# EAGLE board ASIC_card (EAGLE 6.3), part 1 of 2
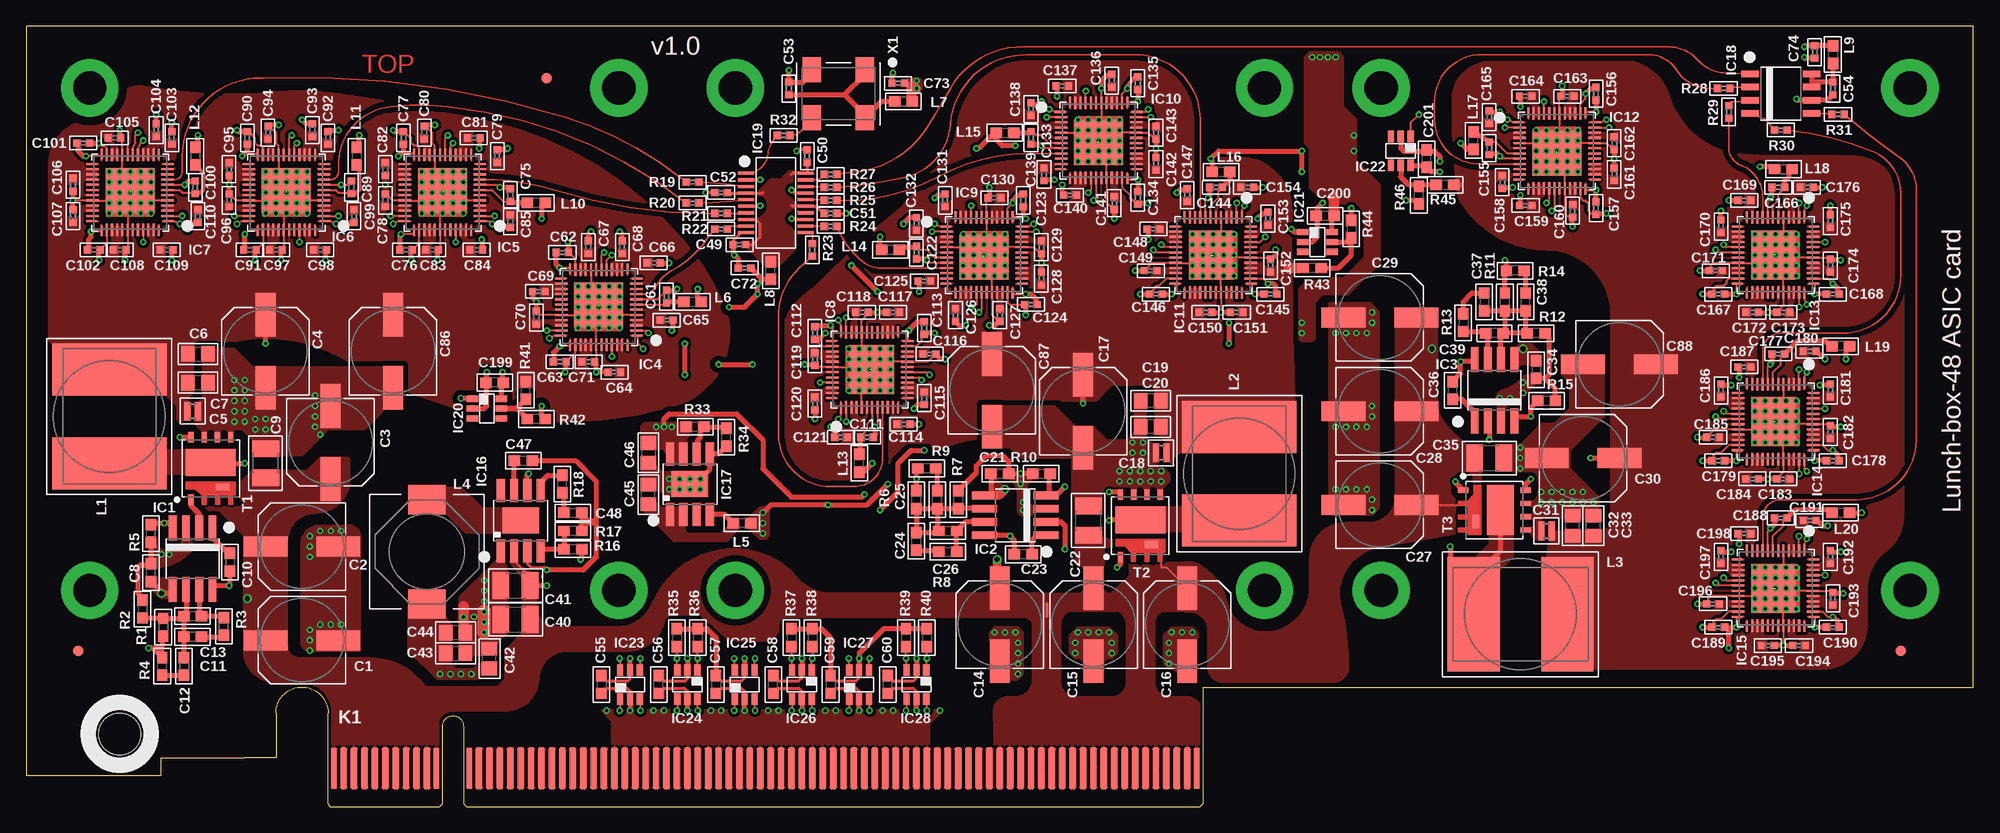
[diagram p4: board, top side]
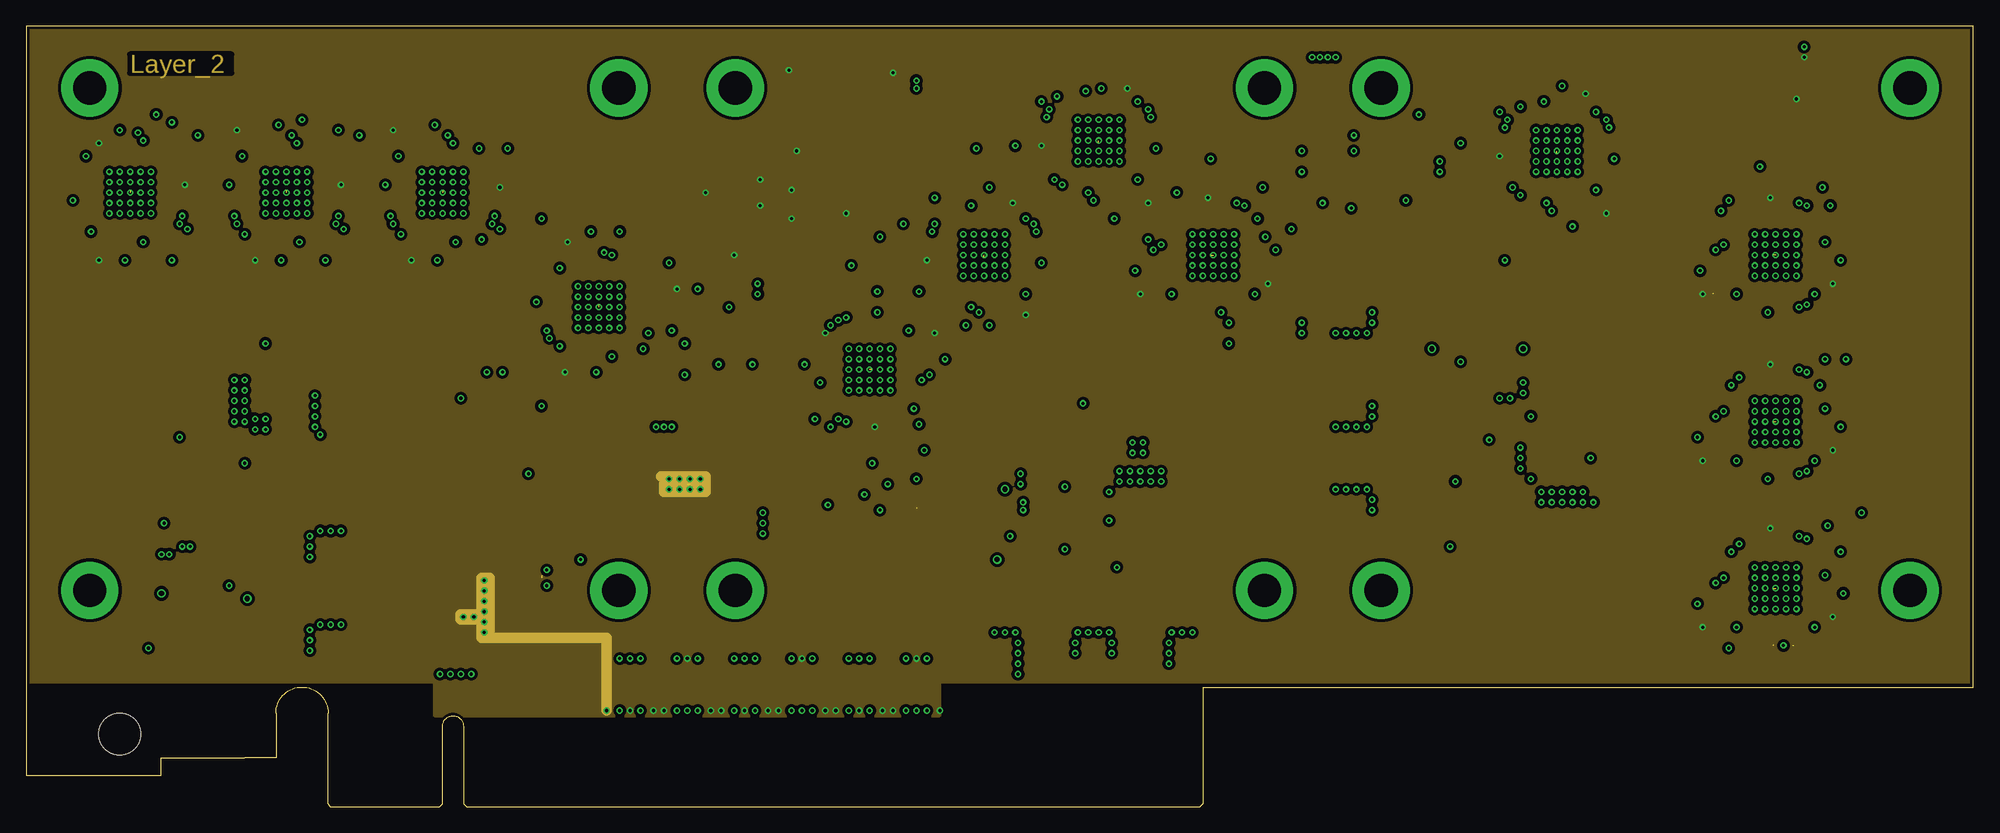
[diagram p5: board, inner layer Route2]
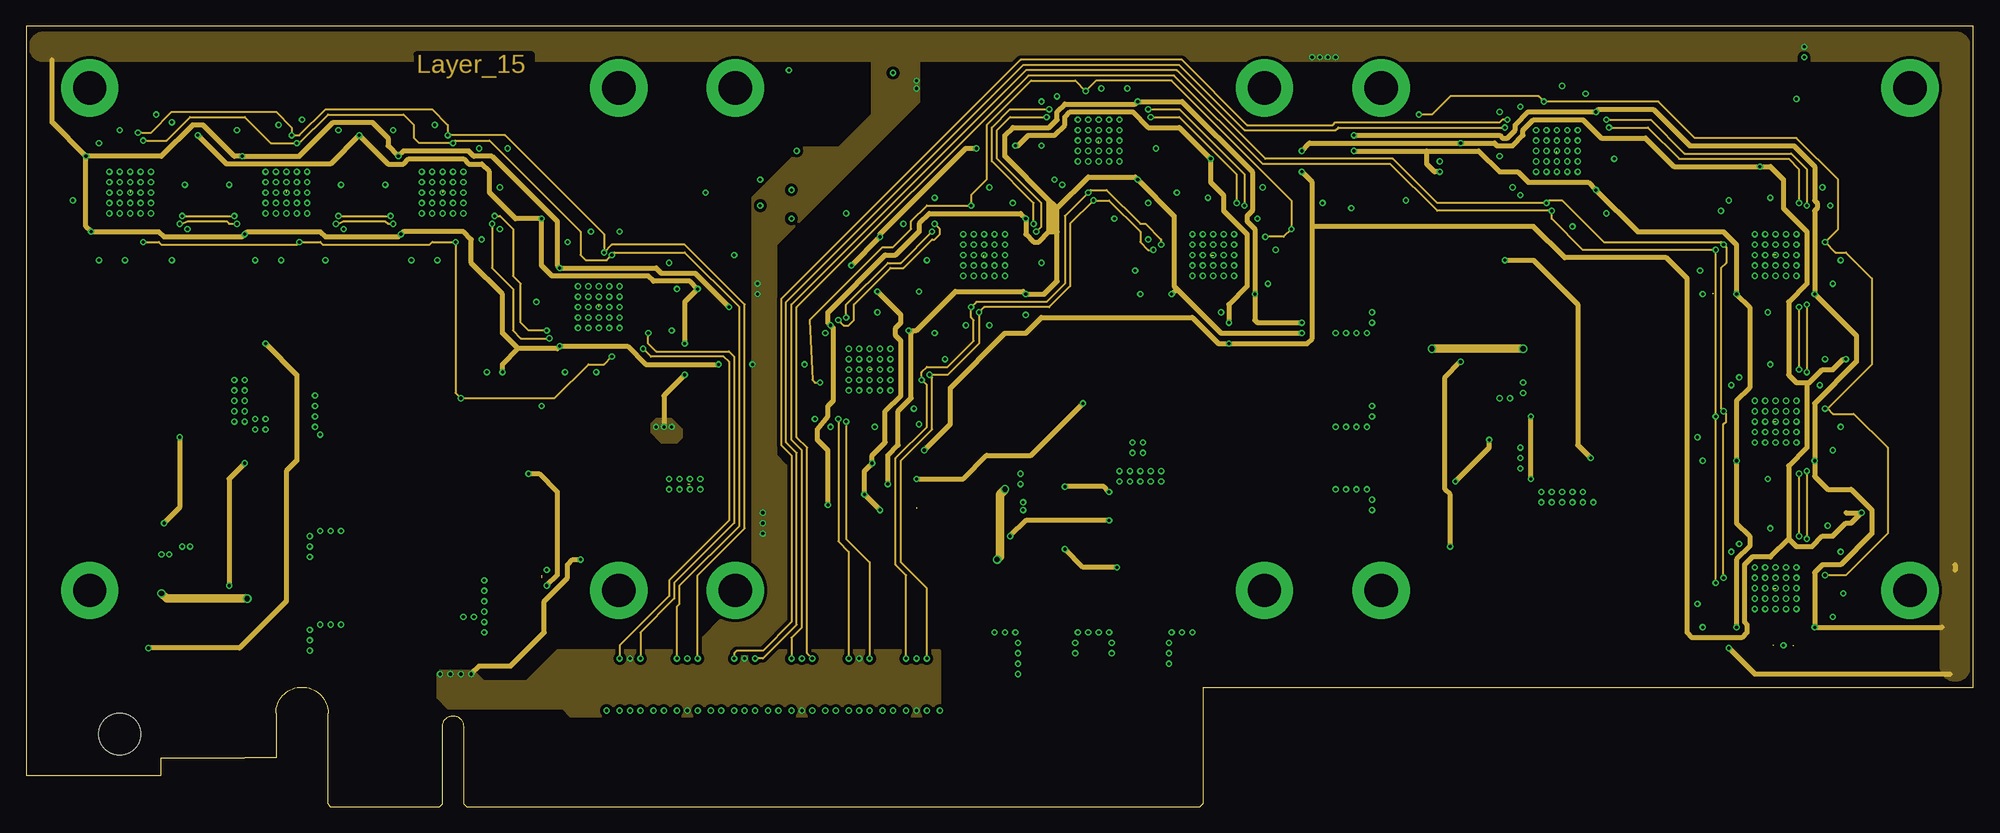
[diagram p6: board, inner layer Route15]
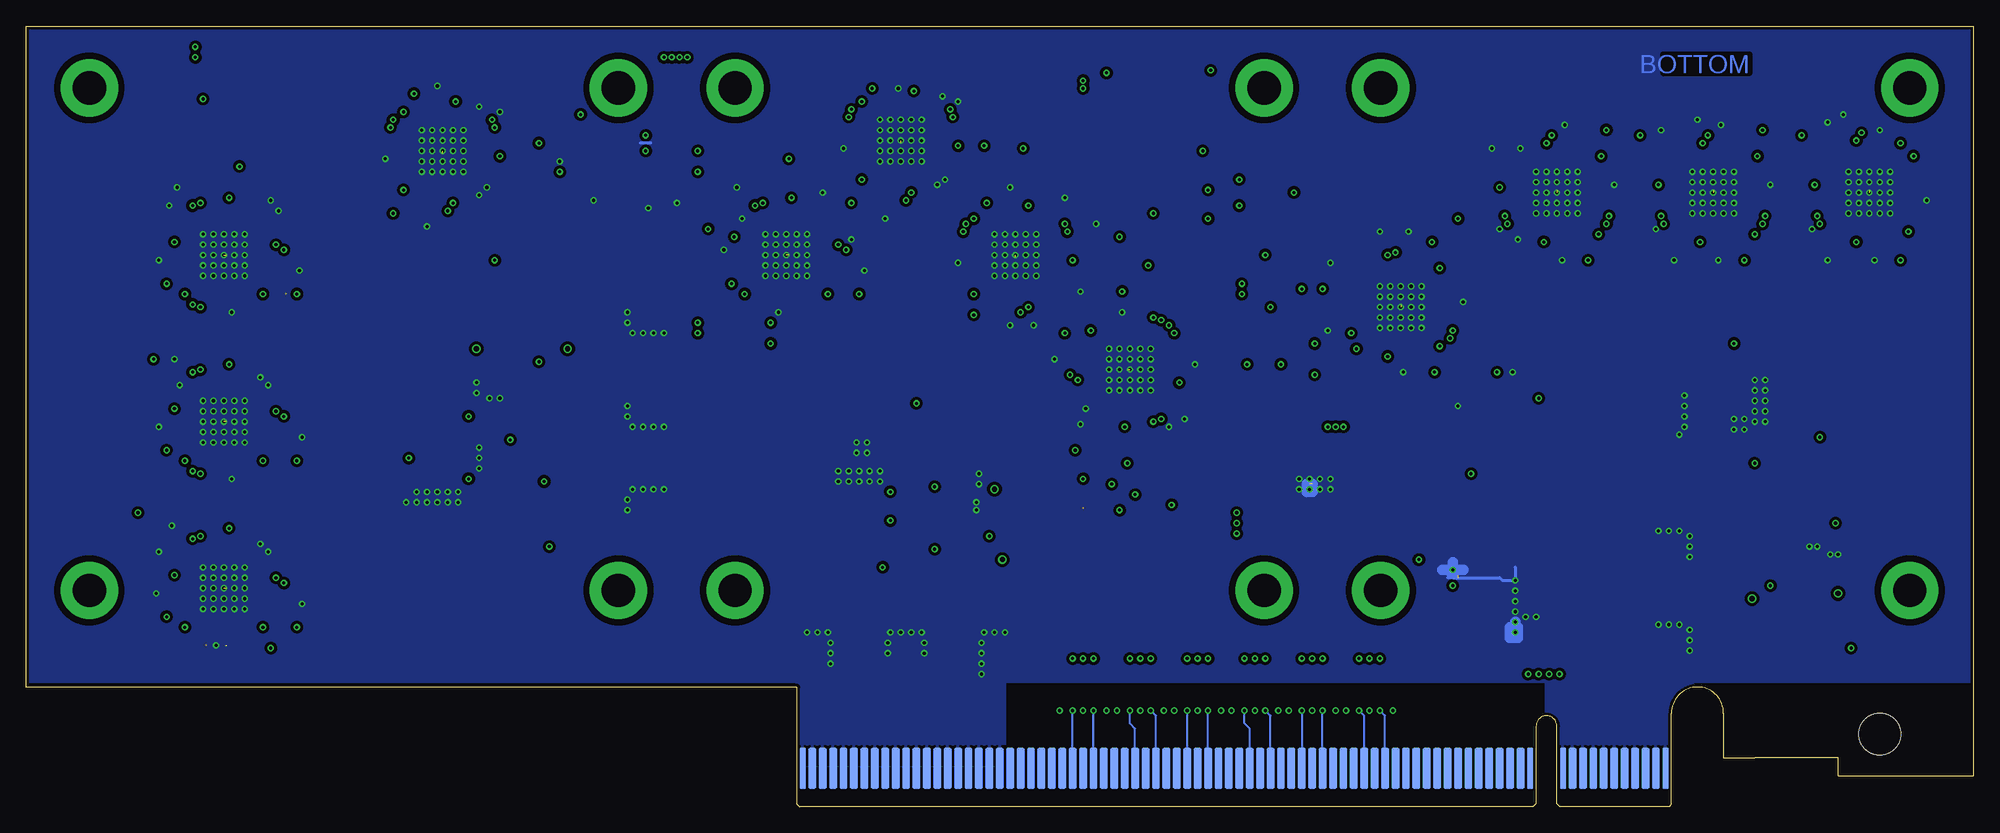
[diagram p7: board, bottom side, seen from below]

Size 187 x 75 mm. Coordinates in mm from the lower left corner, seen from the top.
Outline: 114,11.5 187,11.5 187,75 0,75 0,3 13,3 13,4.7 21,4.7
Copper layers (1*2*15*16): Top 0.035mm / dielectric 0.2mm / Route2 0.0175mm / dielectric 1.1mm / Route15 0.0175mm / dielectric 0.2mm / Bottom 0.035mm
Design rules "SeeedStudio_DRU_no_angle_20130527 *": minimum track width 6mil, minimum drill 0.3mm, track to track 6mil, track to pad 6mil, pad to pad 6mil, via to via 6mil, smd to smd 0mil, copper to edge 10mil, drill to drill 10mil, minimum pad ring 6mil, minimum via ring 6mil, stop-mask expansion 2mil, vias tented up to drill 25mil, thermal gap 10mil
Holes 4 mm at 9,7

## Footprints (pad centres in the part's own frame; a part is rotated, then mirrored left to right if it is on the bottom)
CAP_POL_8MM = smd 4.2 x 1.9: P$1 -3.5,0; P$2 3.5,0
0306 = smd 0.6 x 1.8: 1 -0.5,0; 2 0.5,0
0805 = smd 1.3 x 1.5: 1 -0.95,0; 2 0.95,0
0603 = smd 1.1 x 1: 1 -0.85,0; 2 0.85,0
1210 = smd 1.6 x 2.6: 1 -1.4,0; 2 1.4,0
0402 = smd 0.7 x 0.7: 1 -0.6,0; 2 0.6,0
FID_1X2,5 = smd 1 x 1: 1 0,0
1/2_BRICK_HEATSINK = drill 3.2 pad 5.5: P$1 5.08,4.795; P$2 55.88,4.795; P$3 55.88,53.055; P$4 5.08,53.055
SO-8_BIGPADS = smd 0.75 x 2.4: 1 -1.905,-2.958; 2 -0.635,-2.958; 3 0.635,-2.958; 4 1.905,-2.958; 5 1.905,2.958; 6 0.635,2.958; 7 -0.635,2.958; 8 -1.905,2.958
QFN48_EP = smd 1 x 0.2: 1 -3.7,2.75; 12 -3.7,-2.75; 25 3.7,-2.75; 36 3.7,2.75 | smd 1.2 x 0.2: 2 -3.6,2.25; 3 -3.6,1.75; 4 -3.6,1.25; 5 -3.6,0.75; 6 -3.6,0.25; 7 -3.6,-0.25; 8 -3.6,-0.75; 9 -3.6,-1.25; 10 -3.6,-1.75; 11 -3.6,-2.25; 26 3.6,-2.25; 27 3.6,-1.75; 28 3.6,-1.25; 29 3.6,-0.75; 30 3.6,-0.25; 31 3.6,0.25; 32 3.6,0.75; 33 3.6,1.25; 34 3.6,1.75; 35 3.6,2.25 | smd 0.2 x 1: 13 -2.75,-3.7; 24 2.75,-3.7; 37 2.75,3.7; 48 -2.75,3.7 | smd 0.2 x 1.2: 14 -2.25,-3.6; 15 -1.75,-3.6; 16 -1.25,-3.6; 17 -0.75,-3.6; 18 -0.25,-3.6; 19 0.25,-3.6; 20 0.75,-3.6; 21 1.25,-3.6; 22 1.75,-3.6; 23 2.25,-3.6; 38 2.25,3.6; 39 1.75,3.6; 40 1.25,3.6; 41 0.75,3.6; 42 0.25,3.6; 43 -0.25,3.6; 44 -0.75,3.6; 45 -1.25,3.6; 46 -1.75,3.6; 47 -2.25,3.6 | smd 4.7 x 4.3: EP 0,-0.2
SO-8_EP = smd 0.8 x 2.2: 1 -1.905,-2.905; 2 -0.635,-2.905; 3 0.635,-2.905; 4 1.905,-2.905; 5 1.905,2.905; 6 0.635,2.905; 7 -0.635,2.905; 8 -1.905,2.905 | smd 3.5 x 2.5: EP 0,0
SO-8 = smd 0.635 x 1.7: 1 -1.905,-2.958; 2 -0.635,-2.958; 3 0.635,-2.958; 4 1.905,-2.958; 5 1.905,2.958; 6 0.635,2.958; 7 -0.635,2.958; 8 -1.905,2.958
SSOP-20 = smd 0.3 x 1.5: 1 -2.857,-2.857; 2 -2.223,-2.857; 3 -1.587,-2.857; 4 -0.953,-2.857; 5 -0.318,-2.857; 6 0.318,-2.857; 7 0.953,-2.857; 8 1.587,-2.857; 9 2.223,-2.857; 10 2.857,-2.857; 11 2.857,2.857; 12 2.223,2.857; 13 1.587,2.857; 14 0.953,2.857; 15 0.318,2.857; 16 -0.318,2.857; 17 -0.953,2.857; 18 -1.587,2.857; 19 -2.223,2.857; 20 -2.857,2.857
SOT23-6 = smd 0.6 x 1.1: 1 -0.95,-1.4; 2 0,-1.4; 3 0.95,-1.4; 4 0.95,1.4; 5 0,1.4; 6 -0.95,1.4
PCI-E_16X = smd 0.55 x 4 bottom: A1 -11.425,3.75; A11 -1.575,3.75; A12 1.575,3.75; A82 71.425,3.75 | smd 0.7 x 4 bottom: A2 -10.5,3.75; A3 -9.5,3.75; A4 -8.5,3.75; A5 -7.5,3.75; A6 -6.5,3.75; A7 -5.5,3.75; A8 -4.5,3.75; A9 -3.5,3.75; A10 -2.5,3.75; A13 2.5,3.75; A14 3.5,3.75; A15 4.5,3.75; A16 5.5,3.75; A17 6.5,3.75; A18 7.5,3.75; A19 8.5,3.75; A20 9.5,3.75; A21 10.5,3.75; A22 11.5,3.75; A23 12.5,3.75; A24 13.5,3.75; A25 14.5,3.75; A26 15.5,3.75; A27 16.5,3.75; A28 17.5,3.75; A29 18.5,3.75; A30 19.5,3.75; A31 20.5,3.75; A32 21.5,3.75; A33 22.5,3.75; A34 23.5,3.75; A35 24.5,3.75; A36 25.5,3.75; A37 26.5,3.75; A38 27.5,3.75; A39 28.5,3.75; A40 29.5,3.75; A41 30.5,3.75; A42 31.5,3.75; A43 32.5,3.75; A44 33.5,3.75; A45 34.5,3.75; A46 35.5,3.75; A47 36.5,3.75; A48 37.5,3.75; A49 38.5,3.75; A50 39.5,3.75; A51 40.5,3.75; A52 41.5,3.75; A53 42.5,3.75; A54 43.5,3.75; A55 44.5,3.75; A56 45.5,3.75; A57 46.5,3.75; A58 47.5,3.75; A59 48.5,3.75; A60 49.5,3.75; A61 50.5,3.75; A62 51.5,3.75; A63 52.5,3.75; A64 53.5,3.75; A65 54.5,3.75; A66 55.5,3.75; A67 56.5,3.75; A68 57.5,3.75; A69 58.5,3.75; A70 59.5,3.75; A71 60.5,3.75; A72 61.5,3.75; A73 62.5,3.75; A74 63.5,3.75; A75 64.5,3.75; A76 65.5,3.75; A77 66.5,3.75; A78 67.5,3.75; A79 68.5,3.75; A80 69.5,3.75; A81 70.5,3.75 | smd 0.55 x 4: B1 -11.425,3.75; B11 -1.575,3.75; B12 1.575,3.75; B82 71.425,3.75 | smd 0.7 x 4: B2 -10.5,3.75; B3 -9.5,3.75; B4 -8.5,3.75; B5 -7.5,3.75; B6 -6.5,3.75; B7 -5.5,3.75; B8 -4.5,3.75; B9 -3.5,3.75; B10 -2.5,3.75; B13 2.5,3.75; B14 3.5,3.75; B15 4.5,3.75; B16 5.5,3.75; B17 6.5,3.75; B18 7.5,3.75; B19 8.5,3.75; B20 9.5,3.75; B21 10.5,3.75; B22 11.5,3.75; B23 12.5,3.75; B24 13.5,3.75; B25 14.5,3.75; B26 15.5,3.75; B27 16.5,3.75; B28 17.5,3.75; B29 18.5,3.75; B30 19.5,3.75; B31 20.5,3.75; B32 21.5,3.75; B33 22.5,3.75; B34 23.5,3.75; B35 24.5,3.75; B36 25.5,3.75; B37 26.5,3.75; B38 27.5,3.75; B39 28.5,3.75; B40 29.5,3.75; B41 30.5,3.75; B42 31.5,3.75; B43 32.5,3.75; B44 33.5,3.75; B45 34.5,3.75; B46 35.5,3.75; B47 36.5,3.75; B48 37.5,3.75; B49 38.5,3.75; B50 39.5,3.75; B51 40.5,3.75; B52 41.5,3.75; B53 42.5,3.75; B54 43.5,3.75; B55 44.5,3.75; B56 45.5,3.75; B57 46.5,3.75; B58 47.5,3.75; B59 48.5,3.75; B60 49.5,3.75; B61 50.5,3.75; B62 51.5,3.75; B63 52.5,3.75; B64 53.5,3.75; B65 54.5,3.75; B66 55.5,3.75; B67 56.5,3.75; B68 57.5,3.75; B69 58.5,3.75; B70 59.5,3.75; B71 60.5,3.75; B72 61.5,3.75; B73 62.5,3.75; B74 63.5,3.75; B75 64.5,3.75; B76 65.5,3.75; B77 66.5,3.75; B78 67.5,3.75; B79 68.5,3.75; B80 69.5,3.75; B81 70.5,3.75
B82559A0142A013 = smd 5 x 11: 1 -4.5,0; 2 4.5,0
SRU1048-6R8Y = smd 2.8 x 3.6: 1 -5,0; 2 5,0
DFN5X6 = smd 0.5 x 1: 1 -1.905,-3; 5 1.905,3; 6 0.635,3; 7 -0.635,3; 8 -1.905,3 | smd 1.27 x 0.635: D1 1.1,-1.8 | smd 4.8 x 2.6: S1_D2 0,0.575
VIA = drill 0.3: P$1 0,0; P$2 0,0
7X5_OSC = smd 1.8 x 2.4: 1 -2.54,-2.3; 2 2.54,-2.3; 3 2.54,2.3; 4 -2.54,2.3

## Placement (x,y rotation side)
C1  150uF/16V  [CAP_POL_8MM]  26.5,16 0 top
C2  150uF/16V  [CAP_POL_8MM]  26.5,25 0 top
C3  150uF/16V  [CAP_POL_8MM]  29.25,35 90 top
C4  820uF/2.5V  [CAP_POL_8MM]  23,43.75 270 top
C5  4.7uF/6.3V  [0306]  16,38 0 top
C6  22uF/6.3V  [0805]  16.5,43.5 0 top
C7  22uF/6.3V  [0805]  16.5,40.75 0 top
C8  2.2uF/25V  [0603]  12,22.5 90 top
C9  22uF/25V  [1210]  23,33 90 top
C10  100n/25V  [0603]  19.57,23.51 270 top
C11  22nF  [0603]  16,16.33 180 top
C12  15nF  [0603]  15.17,13.5 270 top
C13  1.3nF  [0603]  16,18.33 0 top
C14  150uF/16V  [CAP_POL_8MM]  93.5,17.5 270 top
C15  150uF/16V  [CAP_POL_8MM]  102.5,17.5 270 top
C16  150uF/16V  [CAP_POL_8MM]  111.5,17.5 270 top
C17  820uF/2.5V  [CAP_POL_8MM]  101.5,38 270 top
C18  4.7uF/6.3V  [0306]  109,34 180 top
C19  22uF/6.3V  [0805]  108,39 180 top
C20  22uF/6.3V  [0805]  108,36.5 180 top
C21  2.2uF/25V  [0603]  93.5,32 0 top
C22  22uF/25V  [1210]  102,27.5 90 top
C23  100n/25V  [0603]  95.75,24.25 180 top
C24  22nF  [0603]  85.5,25.5 90 top
C25  15nF  [0603]  87.5,29.5 90 top
C26  1.3nF  [0603]  88.5,26.5 0 top
C27  150uF/16V  [CAP_POL_8MM]  130,29 180 top
C28  150uF/16V  [CAP_POL_8MM]  130,38 180 top
C29  150uF/16V  [CAP_POL_8MM]  130,47 180 top
C30  820uF/2.5V  [CAP_POL_8MM]  149.5,33.5 180 top
C31  4.7uF/6.3V  [0306]  146,26.5 180 top
C32  22uF/6.3V  [0805]  148.5,27 90 top
C33  22uF/6.3V  [0805]  150.5,27 90 top
C34  2.2uF/25V  [0603]  145,42 270 top
C35  22uF/25V  [1210]  140.5,33.5 0 top
C36  100n/25V  [0603]  137,40 90 top
C37  22nF  [0603]  140,48.5 270 top
C38  15nF  [0603]  144,48.5 90 top
C39  1.3nF  [0603]  141,45.5 180 top
C40  22uF/25V  [1210]  47,21.25 0 top
C41  22uF/25V  [1210]  47,18 0 top
C42  22uF/6.3V  [0805]  44.5,14.25 90 top
C43  22uF/6.3V  [0805]  41.25,14.75 0 top
C44  22uF/6.3V  [0805]  41.25,16.75 0 top
C45  22uF/6.3V  [0805]  59.75,30 90 top
C46  22uF/6.3V  [0805]  59.75,34 270 top
C47  6.8nF  [0603]  47.75,33.25 0 top
C48  6.8nF  [0603]  52.5,28.25 0 top
C49  100n/16V  [0402]  68.5,54 180 top
C50  100n/16V  [0402]  75,62.5 90 top
C51  100n/16V  [0402]  77.25,57 0 top
C52  100n/16V  [0402]  66.75,59 180 top
C53  100n/16V  [0402]  73.25,69 90 top
C54  100n/16V  [0402]  173.5,69 270 top
C55  100n  [0603]  55.25,11.75 270 top
C56  100n  [0603]  60.75,11.75 90 top
C57  100n  [0603]  66.25,11.75 270 top
C58  100n  [0603]  71.75,11.75 90 top
C59  100n  [0603]  77.25,11.75 270 top
C60  100n  [0603]  82.75,11.75 90 top
C61  1u/6v3  [0402]  61.5,49 90 top
C62  1u/6v3  [0402]  51.5,53.25 0 top
C63  1u/6v3  [0402]  51.25,42.75 0 top
C64  1u/6v3  [0402]  56.5,41.75 180 top
C65  1u/6v3  [0402]  61.5,46.75 0 top
C66  1u/6v3  [0402]  60.25,52.25 0 top
C67  1u/6v3  [0402]  54,53.75 90 top
C68  1u/6v3  [0402]  57.25,53.75 90 top
C69  1u/6v3  [0402]  49.25,49.5 180 top
C70  1u/6v3  [0402]  49,47 90 top
C71  1u/6v3  [0402]  54,42.75 0 top
C72  1u/6v3  [0402]  69,51.75 180 top
C73  1u/6v3  [0402]  83.75,69.5 180 top
C74  1u/6v3  [0402]  171.75,72.5 90 top
C75  1u/6v3  [0402]  46.5,58.75 90 top
C76  1u/6v3  [0402]  36.5,53.5 0 top
C77  1u/6v3  [0402]  36.25,64.25 90 top
C78  1u/6v3  [0402]  34.5,58.25 90 top
C79  1u/6v3  [0402]  45.25,62.5 90 top
C80  1u/6v3  [0402]  38.25,64.75 90 top
C81  1u/6v3  [0402]  43,64.25 0 top
C82  1u/6v3  [0402]  34.5,61.25 270 top
C83  1u/6v3  [0402]  39,53.5 0 top
C84  1u/6v3  [0402]  43.25,53.5 0 top
C85  1u/6v3  [0402]  46.5,56.25 270 top
C86  NC  [CAP_POL_8MM]  35.25,43.75 270 top
C87  NC  [CAP_POL_8MM]  92.75,40 270 top
C88  NC  [CAP_POL_8MM]  153,42.5 180 top
C89  1u/6v3  [0402]  31.25,59.5 90 top
C90  1u/6v3  [0402]  21.25,64.25 90 top
C91  1u/6v3  [0402]  21.5,53.5 0 top
C92  1u/6v3  [0402]  29,64.25 90 top
C93  1u/6v3  [0402]  27.5,65 90 top
C94  1u/6v3  [0402]  23.25,64.75 90 top
C95  1u/6v3  [0402]  19.5,61.25 270 top
C96  1u/6v3  [0402]  19.5,58.25 90 top
C97  1u/6v3  [0402]  24,53.5 0 top
C98  1u/6v3  [0402]  28.25,53.5 0 top
C99  1u/6v3  [0402]  31.5,56.75 270 top
C100  1u/6v3  [0402]  16.25,59.5 90 top
C101  1u/6v3  [0402]  5.5,63.75 0 top
C102  1u/6v3  [0402]  6.5,53.5 0 top
C103  1u/6v3  [0402]  14,64.25 90 top
C104  1u/6v3  [0402]  12.5,65 90 top
C105  1u/6v3  [0402]  8.5,64.25 0 top
C106  1u/6v3  [0402]  4.5,59.75 270 top
C107  1u/6v3  [0402]  4.5,56.75 90 top
C108  1u/6v3  [0402]  9,53.5 0 top
C109  1u/6v3  [0402]  13.5,53.5 0 top
C110  1u/6v3  [0402]  16.5,56.75 270 top
C111  1u/6v3  [0402]  80.75,35.5 0 top
C112  1u/6v3  [0402]  75.75,45.5 270 top
C113  1u/6v3  [0402]  86.25,46 270 top
C114  1u/6v3  [0402]  84.25,36.75 0 top
C115  1u/6v3  [0402]  86.25,39.25 270 top
C116  1u/6v3  [0402]  86.75,43.5 0 top
C117  1u/6v3  [0402]  83.25,47.5 180 top
C118  1u/6v3  [0402]  80.25,47.5 0 top
C119  1u/6v3  [0402]  75.75,43 270 top
C120  1u/6v3  [0402]  75.75,38.75 270 top
C121  1u/6v3  [0402]  78.25,35.5 180 top
C122  1u/6v3  [0402]  85.5,53.25 270 top
C123  1u/6v3  [0402]  95.75,58.25 90 top
C124  1u/6v3  [0402]  96.5,48.25 180 top
C125  1u/6v3  [0402]  86.25,50.5 180 top
C126  1u/6v3  [0402]  89.25,47.25 270 top
C127  1u/6v3  [0402]  93.5,47.25 270 top
C128  1u/6v3  [0402]  97.5,50.75 90 top
C129  1u/6v3  [0402]  97.5,53.75 270 top
C130  1u/6v3  [0402]  93,58.5 180 top
C131  1u/6v3  [0402]  88.25,58.25 90 top
C132  1u/6v3  [0402]  85.5,56 90 top
C133  1u/6v3  [0402]  96.5,64.25 270 top
C134  1u/6v3  [0402]  106.75,58.5 270 top
C135  1u/6v3  [0402]  106.75,69.5 90 top
C136  1u/6v3  [0402]  104.25,69.75 90 top
C137  1u/6v3  [0402]  99.5,69.25 180 top
C138  1u/6v3  [0402]  96.5,67 90 top
C139  1u/6v3  [0402]  97.75,60.75 270 top
C140  1u/6v3  [0402]  100.25,58.75 180 top
C141  1u/6v3  [0402]  104.5,58 270 top
C142  1u/6v3  [0402]  108.5,61.75 90 top
C143  1u/6v3  [0402]  108.5,64.75 270 top
C144  1u/6v3  [0402]  114.25,59.5 180 top
C145  1u/6v3  [0402]  119.5,49.25 0 top
C146  1u/6v3  [0402]  108.5,49.25 180 top
C147  1u/6v3  [0402]  111.5,58.75 90 top
C148  1u/6v3  [0402]  108.25,55.5 180 top
C149  1u/6v3  [0402]  108,51.5 180 top
C150  1u/6v3  [0402]  113.25,47.5 0 top
C151  1u/6v3  [0402]  116.25,47.5 180 top
C152  1u/6v3  [0402]  119.5,52 90 top
C153  1u/6v3  [0402]  119.25,56.5 90 top
C154  1u/6v3  [0402]  117.25,59.5 0 top
C155  1u/6v3  [0402]  140.5,63.25 270 top
C156  1u/6v3  [0402]  150.75,68.5 90 top
C157  1u/6v3  [0402]  150.75,57.5 270 top
C158  1u/6v3  [0402]  141.75,60 270 top
C159  1u/6v3  [0402]  144,57.75 180 top
C160  1u/6v3  [0402]  148.5,57.25 270 top
C161  1u/6v3  [0402]  152.5,60.75 90 top
C162  1u/6v3  [0402]  152.5,63.75 270 top
C163  1u/6v3  [0402]  148,68.25 180 top
C164  1u/6v3  [0402]  144,68.25 180 top
C165  1u/6v3  [0402]  140.5,66.25 90 top
C166  1u/6v3  [0402]  168.25,59.5 180 top
C167  1u/6v3  [0402]  162.5,49.25 180 top
C168  1u/6v3  [0402]  173.5,49.25 0 top
C169  1u/6v3  [0402]  165,58.25 180 top
C170  1u/6v3  [0402]  162.75,55.75 90 top
C171  1u/6v3  [0402]  162.25,51.5 180 top
C172  1u/6v3  [0402]  165.75,47.5 0 top
C173  1u/6v3  [0402]  168.75,47.5 180 top
C174  1u/6v3  [0402]  173.25,52 90 top
C175  1u/6v3  [0402]  173.25,56.25 90 top
C176  1u/6v3  [0402]  171,59.5 0 top
C177  1u/6v3  [0402]  168.25,43.5 180 top
C178  1u/6v3  [0402]  173.5,33.25 0 top
C179  1u/6v3  [0402]  162.5,33.25 180 top
C180  1u/6v3  [0402]  171.25,43.75 0 top
C181  1u/6v3  [0402]  173.25,40 90 top
C182  1u/6v3  [0402]  173.25,36 90 top
C183  1u/6v3  [0402]  168.75,31.5 180 top
C184  1u/6v3  [0402]  165.75,31.5 0 top
C185  1u/6v3  [0402]  162,35.5 180 top
C186  1u/6v3  [0402]  162.75,40 90 top
C187  1u/6v3  [0402]  165,42.25 180 top
C188  1u/6v3  [0402]  168.5,27.75 180 top
C189  1u/6v3  [0402]  162.5,17.25 180 top
C190  1u/6v3  [0402]  173.5,17.25 0 top
C191  1u/6v3  [0402]  171.25,27.5 0 top
C192  1u/6v3  [0402]  173.25,24 90 top
C193  1u/6v3  [0402]  173.5,20 90 top
C194  1u/6v3  [0402]  170.25,15.5 180 top
C195  1u/6v3  [0402]  167.25,15.5 0 top
C196  1u/6v3  [0402]  162,19.5 180 top
C197  1u/6v3  [0402]  162.75,24 90 top
C198  1u/6v3  [0402]  165,26.25 180 top
C199  100n  [0603]  45,40.75 180 top
C200  100n  [0603]  124.75,56.75 180 top
C201  100n  [0603]  134.5,62.25 90 top
FID1  FIDUCIAL  [FID_1X2,5]  5,15 0 top
FID2  FIDUCIAL  [FID_1X2,5]  50,70 0 top
FID3  FIDUCIAL  [FID_1X2,5]  180,15 0 top
HS1  HALFBRICK_HEATSINK  [1/2_BRICK_HEATSINK]  62,16 0 bottom
HS2  HALFBRICK_HEATSINK  [1/2_BRICK_HEATSINK]  124,16 0 bottom
HS3  HALFBRICK_HEATSINK  [1/2_BRICK_HEATSINK]  186,16 0 bottom
IC1  ISL6545  [SO-8_BIGPADS]  16,23.83 180 top
IC2  ISL6545  [SO-8_BIGPADS]  95,28 90 top
IC3  ISL6545  [SO-8_BIGPADS]  141,40 0 top
IC4  A3256-Q48  [QFN48_EP]  55,48 180 top
IC5  A3256-Q48  [QFN48_EP]  40,59 180 top
IC6  A3256-Q48  [QFN48_EP]  25,59 180 top
IC7  A3256-Q48  [QFN48_EP]  10,59 180 top
IC8  A3256-Q48  [QFN48_EP]  81,42 90 top
IC9  A3256-Q48  [QFN48_EP]  92,53 0 top
IC10  A3256-Q48  [QFN48_EP]  103,64 0 top
IC11  A3256-Q48  [QFN48_EP]  114,53 270 top
IC12  A3256-Q48  [QFN48_EP]  147,63 0 top
IC13  A3256-Q48  [QFN48_EP]  168,53 270 top
IC14  A3256-Q48  [QFN48_EP]  168,37 270 top
IC15  A3256-Q48  [QFN48_EP]  168,21 270 top
IC16  AOZ1050PI  [SO-8_EP]  47.5,27.5 0 top
IC17  AP7165-SPG-13  [SO-8_EP]  63.75,31 0 top
IC18  NB3N551DG  [SO-8]  168.5,68.5 270 top
IC19  PI49FCT3807C  [SSOP-20]  72,58 270 top
IC20  STM6780TWB6F  [SOT23-6]  44.25,38.25 270 top
IC21  STM6780TWB6F  [SOT23-6]  124,54.25 270 top
IC22  STM6780TWB6F  [SOT23-6]  132,63 180 top
IC23  74LVC2G17GV  [SOT23-6]  58,11.75 0 top
IC24  74LVC2G17GV  [SOT23-6]  63.5,11.75 180 top
IC25  74LVC2G17GV  [SOT23-6]  69,11.75 0 top
IC26  74LVC2G17GV  [SOT23-6]  74.5,11.75 180 top
IC27  74LVC2G17GV  [SOT23-6]  80,11.75 0 top
IC28  74LVC2G17GV  [SOT23-6]  85.5,11.75 180 top
K1  DO NOT INSERT INTO A REGULAR PCI-E SLOT!!!  [PCI-E_16X]  41,-0.05 0 top
L1  1.4uH  [B82559A0142A013]  8,37.5 90 top
L2  1.4uH  [B82559A0142A013]  116.5,32 90 top
L3  1.4uH  [B82559A0142A013]  143.5,18.5 0 top
L4  6.8uH  [SRU1048-6R8Y]  38.5,24.5 270 top
L5  30R@100MHz  [0603]  68.75,27.25 180 top
L6  30R@100MHz  [0603]  64,48.5 180 top
L7  30R@100MHz  [0603]  84.25,67.75 180 top
L8  30R@100MHz  [0603]  71.5,51.5 90 top
L9  30R@100MHz  [0603]  173.5,72.25 270 top
L10  30R@100MHz  [0603]  49,58 180 top
L11  30R@100MHz  [0603]  31.75,62.5 270 top
L12  30R@100MHz  [0603]  16.25,62.5 270 top
L13  30R@100MHz  [0603]  80,33 90 top
L14  30R@100MHz  [0603]  83,53.5 0 top
L15  30R@100MHz  [0603]  94,64.75 0 top
L16  30R@100MHz  [0603]  114.75,61 0 top
L17  30R@100MHz  [0603]  139,64 90 top
L18  30R@100MHz  [0603]  168.75,61.25 0 top
L19  30R@100MHz  [0603]  174.25,44.25 180 top
L20  30R@100MHz  [0603]  174.25,28.25 180 top
R1  3k3  [0603]  13.17,17.25 270 top
R2  3k3  [0603]  11.17,19 270 top
R3  5k23  [0603]  19,17.33 90 top
R4  52R3  [0603]  13.08,13.5 90 top
R5  1k5  [0603]  12,26.25 90 top
R6  3k3  [0603]  85.5,29.5 90 top
R7  3k3  [0603]  89.5,29.5 270 top
R8  5k23  [0603]  88.5,24.5 0 top
R9  52R3  [0603]  86.5,32.5 180 top
R10  1k5  [0603]  97.5,32 0 top
R11  3k3  [0603]  142,48.5 90 top
R12  3k3  [0603]  145,45.5 180 top
R13  5k23  [0603]  138,46.5 270 top
R14  52R3  [0603]  143,51.5 180 top
R15  1k5  [0603]  146,39 180 top
R16  31k6  [0603]  52.5,24.75 0 top
R17  10k  [0603]  52.5,26.5 180 top
R18  10k  [0603]  51.5,31 90 top
R19  59R  [0402]  64,60 180 top
R20  59R  [0402]  64,58 180 top
R21  59R  [0402]  66.75,57 180 top
R22  59R  [0402]  66.75,55.5 180 top
R23  59R  [0402]  75.5,53.5 270 top
R24  59R  [0402]  77.25,55.75 0 top
R25  59R  [0402]  77.25,58.25 0 top
R26  59R  [0402]  77.25,59.5 0 top
R27  59R  [0402]  77.25,60.75 0 top
R28  59R  [0402]  163,69 180 top
R29  59R  [0402]  163.5,66.75 270 top
R30  59R  [0402]  168.5,65 0 top
R31  59R  [0402]  174,66.5 0 top
R32  59R  [0402]  72.75,64.5 180 top
R33  31k6  [0603]  64.25,36.5 180 top
R34  15k8  [0603]  67.25,35.5 90 top
R35  470R  [0603]  62.5,16.25 270 top
R36  470R  [0603]  64.5,16.25 270 top
R37  470R  [0603]  73.5,16.25 270 top
R38  470R  [0603]  75.5,16.25 270 top
R39  470R  [0603]  84.5,16.25 270 top
R40  470R  [0603]  86.5,16.25 270 top
R41  3k3  [0603]  48,40 90 top
R42  5k23  [0603]  49,37.25 180 top
R43  3k3  [0603]  123.5,51.75 180 top
R44  5k23  [0603]  127.25,55.5 270 top
R45  3k3  [0603]  136.25,59.75 0 top
R46  5k23  [0603]  133.75,58.75 90 top
T1  AON9673A  [DFN5X6]  17.75,32.5 0 top
T2  AON9673A  [DFN5X6]  107,27 0 top
T3  AON9673A  [DFN5X6]  141,28.5 270 top
VIA1  VIA  [VIA]  50,22.75 0 top
VIA2  VIA  [VIA]  63.75,30.5 0 top
VIA3  VIA  [VIA]  44,16.75 0 top
X1  CB3LV-3C-32M0000  [7X5_OSC]  78,68.5 180 top

## Tracks (layer width: path | path; a pad name or v marks a point on that pad's centre or on a via)
1.2V_1  (via drill 0.3)
  Top 0.2: IC7.19 9.75,63.5
  Top 0.5: v23,44.5 23,46 | 12.18,15.25 R4.2 12.92,14.51 R1.2 | 12.18,15.25 v11.75,15.25 | 12.18,15.25 12.75,15.25
  Route15 0.5: v23,44.5 26,41.5 26,33.25 25,32.25 25,19.75 20.5,15.25 v11.75,15.25
  pour Top (isolate 0.5, rank 2, no thermals): 2.75,40.75 2.75,44.25 2.25,44.75 2.25,61.5 arc-90 6.25,66 arc53 9,68.25 arc-58 11,69.25 arc13 22.25,68.5 arc-16 30,68.5 arc-5 44.75,65.75 arc-37 63,54.5 arc-13 66.75,48.75 arc-100 62.25,38.5 arc-48 31,42.75 arc42 20.25,44.75 arc-21 20,44.75 16.25,44.75 16,44.5 16,39.75 15.5,39.25 15.5,37.5 15,37 14.75,37 14.5,37.25 14.5,38.5 13.25,39.75 3.75,39.75
  pour Top (isolate 0.3, no thermals): 58.25,50.25 59.5,50.25 60.75,51.5 arc-26 62.75,52.75 59.5,56 52.5,56 50.75,54.25 50.25,54.25 47.75,51.75 47.75,46.75 49.25,45.25 49.25,41.75 50.25,40.75 57.75,40.75 61.25,40.25 64.5,40.5 64.75,47 65.75,47 66,47.25 66,49.5 65,50.5 61.75,50.5 61.5,50.25 61.5,48.5 61.25,48.25 58.25,48.25 58.25,44.75 51.75,44.75 51.75,51.25 58.25,51.25
  pour Top (isolate 0.3, rank 2, no thermals): 43.25,62.25 43.25,61 48,61 48,63.25 44.5,65.25 arc37 44,65.5 arc1 39.5,66.25 arc13 35.75,66.25 arc80 33,62.25 33,52.75 34.25,51.75 41.5,51.75 42.25,51.25 44.25,51.25 49,55.5 50,55.5 51.5,57.5 51.25,57.5 50.5,58.25 45.5,58.25 44.25,59.5 43.25,59.5 43.25,55.75 36.75,55.75 36.75,62.25
  pour Top (isolate 0.3, no thermals): 28.25,59.75 28.25,55.75 21.75,55.75 21.75,62.25 28.25,62.25 28.25,61.25 29.3,61.25 29.3,61.5 arc-25 30,64.6 arc-20 31,66 28.8,68.2 21.7,68.2 16.4,65.4 17.8,64.4 17.8,53.4 19.4,51.8 30.9,51.8 32.8,53.7 32.8,60.4 31.85,60.35 30.65,60.35 30.05,59.75
  pour Top (isolate 0.3, no thermals): 13.25,59.75 15,59.75 16,60.75 16,65 17.75,65 17.75,54.25 15.5,51.5 5.25,51.5 3.5,54 3.5,64 4.5,65 7,65 7.5,65.5 8.75,66 10.5,67.25 14.5,67.25 15,65.75 14.25,63.25 14.25,61.25 13.25,61.25 13.25,62.25 6.75,62.25 6.75,55.75 13.25,55.75
1.2V_2  (via drill 0.3)
  Top 0.5: R6.2 v85.5,31.5 85.5,32.35 R9.2 | v101.5,38.75 C17.P$1
  Top 1: R43.2 121.25,51.75
  Route15 0.5: v85.5,31.5 90,31.5 92.25,33.75 96.5,33.75 v101.5,38.75
  pour Top (isolate 0.5, rank 2, no thermals): 90.5,35.25 76.75,31.25 arc-90 72.5,35.5 arc-7 72.5,45.25 arc-49 75.5,49.75 arc1 81.5,55.5 arc19 85.5,59.25 arc25 89.5,65.75 arc-61 94.5,71.5 arc-15 95.75,71.75 arc-8 106.75,71.75 arc-90 112.25,66.25 112.25,63.25 arc90 113,62.5 116.25,62.5 arc-90 121.5,57.25 arc2 121.75,39.75 121.75,34 111,34 arc90 110,33 109.5,33 109.5,35 108.5,36 108.5,40 108,40.5 104.25,40.5 102.75,39 94.75,39 arc90 92.75,37.25 arc-90
  pour Top (isolate 0.3, no thermals): 83.25,38.75 83,37.75 arc28 83,36.5 83,35 89,35 89,49.75 76.5,49.75 73,46.25 73,39 73,35.75 77.25,31.5 79,31.5 81.5,34 81.5,37.25 81.5,38.75 77.75,38.75 77.75,45.25 84.25,45.25 84.25,38.75
  pour Top (isolate 0.3, no thermals): 88.75,52.25 87.25,52.25 86.75,52.75 81.5,52.75 81.5,55.5 85.5,58.75 90.5,60.75 97.5,60.75 100.75,57.75 100.5,45.75 100.25,45.5 89.25,45.5 84.5,48.25 84.25,51 88.75,51 88.75,49.75 95.25,49.75 95.25,56.25 88.75,56.25
  pour Top (isolate 0.3, no thermals): 79,52.75 81.75,50.75 83.5,49.25 83.5,45.25 82.5,45.25 82.5,46.75 78,51.25 78,51.75
  pour Top (isolate 0.3, no thermals): 99.75,63.25 91,63.25 90.25,62.5 90.25,67.25 94.25,71.25 108,71.25 111.75,67.5 111.75,60 107.75,55.75 100.25,55.75 95.75,60.5 95.75,62 99.75,62 99.75,60.75 106.25,60.75 106.25,67.25 99.75,67.25
  pour Top (isolate 0.3, no thermals): 112.25,56.25 112.25,57.25 112,57.5 112,61 107.75,61 107.75,58.25 105.25,55.75 105.25,47.25 108.25,43.75 119.75,43.75 121.5,46 121.5,56.25 121.25,56.5 121.25,58.5 119.5,61.25 117.5,62.25 115.25,62.5 113.75,62.5 113.75,58.5 113.25,57.25 113.25,56.25 117.25,56.25 117.25,49.75 110.75,49.75 110.75,56.25
1.2V_3  (via drill 0.3)
  Top 0.5: R11.2 142,51.35 R14.2 142.15,52.35 v142,52.5 | v150.25,33.5 152.5,33.5 | R45.2 137.75,59.75
  Route15 0.5: v142,52.5 144.75,52.5 149,48.25 149,34.75 v150.25,33.5
  pour Top (isolate 0.5, rank 2, no thermals): 145.75,21.5 146.25,25 146.5,26.5 151.25,26.5 arc90 152.25,27.5 152.25,47.25 arc90 146,53.5 arc-60 137.75,58.25 arc-23 137.5,59 arc-7 137,67.5 arc-93 141.5,71.75 153,71.75 arc-73 157.75,68.25 arc66 164.25,62.75 arc6 169,62.5 175.75,62.5 arc-90 180.25,57 180.25,28 arc-53 178.5,24.5 arc53 176.75,21 176.75,17.5 arc-90 172.5,13.25 148,13.25 arc-90 145.75,15.5
  pour Top (isolate 0.3, no thermals): 143.75,62.25 139.5,62.25 arc-90 137,64.75 137,68 arc-90 140.5,71.5 152.75,71.5 arc-90 157.25,67 157.25,61 arc-90 149.75,53.5 arc-46 138,58.5 arc-99 138.25,61 143,61 143,61.25 143.75,61.25 143.75,59.75 150.25,59.75 150.25,66.25 143.75,66.25
  pour Top (isolate 0.3, no thermals): 166,56.25 166,58.75 arc90 164,60.75 163,60.75 arc90 159,55.75 159,49 arc90 163.75,44.25 arc28 166.25,45.5 167.25,46.25 174.5,46.25 arc90 178.25,50 178.5,57 arc90 174,62.5 166.5,62.5 arc90 165.75,62.25 arc26 167.5,58.5 167.5,57.25 167.25,57 167.25,56.25 171.25,56.25 171.25,49.75 164.75,49.75 164.75,56.25
  pour Top (isolate 0.3, no thermals): 167.25,40.25 167.25,42.25 167.75,44.25 174.5,44.75 177.25,44.25 179.75,41.75 179.75,35.5 arc-93 174.25,30.25 161.25,30.25 158.25,33.25 158.25,41 162.25,45 165.25,45 166,44.25 166,41 166.25,40.75 166.25,40.25 164.75,40.25 164.75,33.75 171.25,33.75 171.25,40.25
  pour Top (isolate 0.3, no thermals): 167.25,24.5 167.25,27.75 168.25,28.75 180,28.75 180,27.75 arc-90 176.5,24.25 arc90 176,23.75 176,21.75 176,17.25 arc-90 172.25,13.5 162.25,13.5 arc-90 158.25,17.5 158.25,24 arc-90 163.25,29 164.75,29 arc-90 166,27.75 166,25.25 166.25,25 166.25,24.25 164.75,24.25 164.75,17.75 171.25,17.75 171.25,24.25 167.25,24.25
1.2V_PLL  (via drill 0.3)
  Top 0.4: 80,32.5 80.75,32.5
  Top 0.5: L6.1 64.5,48.85 v64.5,49.75 | L10.1 49.5,57.65 v49.5,56.5 | L11.1 32,63.6 v32,64.5 | L12.1 16.5,63.6 v16.5,64.5 | v63.25,44.5 v63.25,41.5 | L13.1 80.4,32.15 80.75,32.5 v81.25,33 | v81.75,49.5 v79.25,52 | 81.9,53.25 L14.1 82,53.6 v82,54.75 | L15.1 93.15,64.5 92.75,64.5 | 92.75,64.5 91.5,63.25 v91.25,63.25 | v95,63.5 93.75,63.5 92.75,64.5 | L16.1 113.9,62.1 v113.75,62.25 114.5,63 v122.5,63 v122.5,61 | v82,28.5 83.75,30.25 83.75,33 85,34.25 v86.25,34.25 | v115.5,46.5 v115.5,44.5 | L17.1 138.35,63.15 138.25,63.25 | 138.25,63.25 v137.75,63.75 | 138.75,63.25 138.25,63.25 | L18.1 167.65,61.5 v166.5,61.5 | L19.1 174.75,43.9 v174.75,43 | L20.1 v176.25,28.25 | v61.25,36.5 61.25,37.25 61.75,37.75 68.25,37.75 70.75,35.25 70.75,32.5 73.5,29.75 80.25,29.75 v80.5,30
  Route15 0.5: v16.5,64.5 19.25,61.75 29.25,61.75 v32,64.5 34.75,61.75 36.25,61.75 36.75,62.25 42,62.25 42.5,61.75 43.75,61.75 44.5,61 44.5,59 47,56.5 v49.5,56.5 49.5,52 50.5,51 59.75,51 60.25,50.5 63.75,50.5 v64.5,49.75 63.25,48.5 v63.25,44.5 | v63.25,41.5 61.25,39.5 v61.25,36.5 | v81.75,49.5 84,47.25 84,46.5 83.5,46 83.5,45.25 84,44.75 84,39.5 82.5,38 82.5,35 81.25,33.75 v81.25,33 80.5,32.25 v80.5,30 v82,28.5 | v79.25,52 v82,54.75 82,55 90.25,63.25 v91.25,63.25 | v95,63.5 95.25,63.5 96.25,64.5 98.75,64.5 99.75,65.5 99.75,66.25 100.25,66.75 106.25,66.75 107.75,65.25 110.75,65.25 v113.75,62.25 113.75,60 115,58.75 115,57.25 117.25,55 117.25,50 115.5,48.25 v115.5,46.5 | v86.25,34.25 88.75,36.75 88.75,40.25 94,45.5 96,45.5 97.5,47 112,47 114.5,44.5 v115.5,44.5 123,44.5 123.5,45 123.5,55.75 | 123.5,55.75 123.5,60 v122.5,61 | v122.5,63 123.25,63.75 v137.75,63.75 141,63.75 141.25,63.5 142.75,63.5 143.75,64.5 143.75,65 144.75,66 149.5,66 151.25,64.25 155.5,64.25 158.25,61.5 v166.5,61.5 167.5,61.5 168.75,60.25 168.75,57.5 171,55.25 171,50.25 169.25,48.5 169.25,41.5 170,40.75 171,40.75 | 171,40.75 171.25,40.75 172.5,42 173.5,42 174.5,43 v174.75,43 | 171,40.75 171,34.5 169.25,32.75 169.25,25.75 | 169.25,25.75 170,25 171.5,25 172.5,26 173.5,26 174.75,27.25 175.25,27.25 v176.25,28.25 174.75,28.25 | 169.25,25.75 167.5,24 165.75,24 165,23.25 165,17.75 165.25,17.5 165.25,16.75 164.75,16.25 160,16.25 159.5,16.75 159.5,50.75 157.5,52.75 147.75,52.75 144.75,55.75 123.5,55.75
  other vias: 60.5,36.5 62,36.5
  pour Top (no thermals): 61.75,33.25 61.75,34 61.25,34.5 60.5,34.5 60.25,34.75 59.25,34.75 59.25,36.5 59.5,36.75 63.5,36.75 63.5,35.75 63.25,35.5 63.25,33.25
  pour Route15 (isolate 0.3, no thermals): 60.5,37.25 60,36.75 60,36.25 60,36 61,35 62.5,35 63,35.5 63,36 63,36.25 62,37.25
1.2V_PLL1
  Top 0.2: IC4.7 61.35,48.25 C61.1
  Top 0.5: L6.2 61.6,48.5 C61.1
1.2V_PLL2
  Top 0.2: IC5.7 44.75,59.25 45.85,58.15 C75.1
  Top 0.5: L10.2 46.6,58 C75.1
1.2V_PLL3
  Top 0.2: IC6.7 29.75,59.25 30,59 31.15,59 C89.1
  Top 0.4: L11.2 32,61.4 32,59.25 31.75,59 | 31.75,59 31.65,58.9 C89.1 | 31.25,59 31.75,59
1.2V_PLL4
  Top 0.2: 16.15,58.75 C100.1 16.15,59 15,59 14.75,59.25 IC7.7
  Top 0.4: L12.2 17,60.9 17,59.25 16.75,59 16.5,59 | C100.1 16.4,58.9 16.5,59 | 16.25,59 16.5,59
1.2V_PLL5
  Top 0.2: IC8.7 81.25,37.25 80.75,36.75 80.75,36.25 80.5,36 C111.1
  Top 0.5: L13.2 80.15,34 C111.1
1.2V_PLL6
  Top 0.2: IC9.7 87.25,52.75 86.5,53.5 85.85,53.5 C122.1
  Top 0.5: L14.2 84.1,53.75 85.4,53.75 C122.1
1.2V_PLL7
  Top 0.2: IC10.7 98.25,63.75 97.5,64.5 97,64.5 C133.1
  Top 0.5: L15.2 96.4,64.75 arc90 C133.1
1.2V_PLL8
  Top 0.2: IC11.7 113.75,57.75 114.5,58.5 114.5,59.15 C144.1
  Top 0.5: L16.2 115.6,60.25 C144.1
1.2V_PLL9
  Top 0.2: IC12.7 142.25,62.75 141.15,63.85 C155.1
  Top 0.5: C155.1 L17.2
1.2V_PLL10
  Top 0.2: IC13.7 167.75,57.75 168.25,58.25 168.25,58.75 C166.1
  Top 0.5: L18.2 169.25,60.9 169.25,60.5 168.85,60.1 C166.1
1.2V_PLL11
  Top 0.2: IC14.7 167.75,41.75 168.5,42.5 168.5,43.15 C177.1
  Top 0.5: L19.2 173.15,44.5 173,44.5 172.75,44.75 170.1,44.75 C177.1
1.2V_PLL12
  Top 0.2: IC15.7 167.75,26 168.75,27 168.75,27.5 169,27.75 C188.1
  Top 0.5: L20.2 173.15,28.5 169.85,28.5 C188.1
3.3V  (via drill 0.3)
  Top 0.2: 51,53.15 C62.1 | 50.75,42.85 C63.1 | C76.1 36,53.6 | IC5.24 37.25,62.75 36.5,62.75 36.25,63 | 36.5,63.5 36.35,63.65 C77.1 | IC5.37 37.25,55 v36,55 | IC4.37 52.2,44.25 v51.25,44.25 | IC4.24 52.2,51.75 v51.25,51.75 | IC6.24 21.55,62.7 21.25,63 | IC6.37 21.3,55.3 v21,55 | v5.75,62.5 7.25,62.5 IC7.24 | IC7.37 7.2,55.25 v6.25,55.25 | IC8.24 84.7,45.7 v84.75,45.75 | IC8.37 77.5,44.75 77.5,46 v77.25,46.25 | IC9.24 94.8,49.25 v96,49.25 | IC9.37 95.8,56.7 v96,56.5 | IC10.37 105.75,67.75 v106.75,67.75 | IC10.24 105.8,60.25 v106.75,60.25 | IC11.24 110.3,49.55 v110,49.25 | IC11.37 117.7,49.55 v118,49.25 | IC12.37 149.8,66.75 v150.75,66.75 | IC12.24 149.8,59.25 v150.75,59.25 | IC13.37 171.75,50.2 v171.75,49.25 | IC13.24 164.25,50.2 v164.25,49.25 | IC14.37 171.75,34.2 v171.75,33.25 | IC14.24 164.25,34.2 v164.25,33.25 | IC15.37 171.75,18.2 v171.75,17.25 | IC15.24 164.25,18.2 v164.25,17.25
  Top 0.3: C55.1 55.75,12.1 57.8,12.1 58,12.3 IC23.5 | C56.1 61.25,11.4 63.2,11.4 63.5,11.1 IC24.5 | C57.1 66.75,12.1 68.7,12.1 69,12.4 IC25.5 | C58.1 72.25,11.4 74.2,11.4 74.5,11.1 IC26.5 | C59.1 77.75,12.1 79.7,12.1 80,12.4 IC27.5 | C60.1 83.25,11.4 85.2,11.4 85.5,11.1 IC28.5
  Top 0.5: R16.2 53.35,23.85 v53.25,23.75 | IC23.5 v58,14.25 | v63.5,9.25 IC24.5 | v69,14.25 IC25.5 | IC26.5 v74.5,9.25 | IC27.5 v80,14.25 80,14.75 82.35,17.1 R39.1 R40.1 | v85.5,9.25 IC28.5 | L8.1 70.7,50.65 | 70.7,50.65 C72.1 | 70.7,50.65 70.3,50.25 v70.25,50.25 v70.25,49.25 69,48 v67.5,48 | L9.1 C74.2 170.85,73.1 v170.75,73 | v36,55 35.9,54.9 C76.1 | v35.75,62.5 36.25,63 C77.1 | v51.25,51.75 50.9,52.1 C62.1 | v51.25,44.25 50.65,43.65 C63.1 | v66.5,42.5 v69.75,42.5 | C90.1 21.25,63 v20.75,62.5 | C91.1 21,53.6 v21,55 | C101.1 5,63.65 5,63 5.5,62.5 v5.75,62.5 | C102.1 6,53.6 6,54.5 6.25,54.75 v6.25,55.25 | v70.75,28.25 71.5,29 v77,29 80.75,29 v82.75,31 | v84.75,45.75 85.6,46.6 C113.1 | C112.1 75.9,46.25 v77.25,46.25 | C124.1 97,48.35 97,48.75 96.5,49.25 v96,49.25 | C123.1 95.75,56.75 v96,56.5 | C135.1 v106.75,67.75 | v106.75,60.25 C134.1 | R35.1 R36.1 65.4,17.1 66.25,16.25 C57.1 | R37.1 R38.1 76.4,17.1 77.25,16.25 C59.1 | C146.1 v110,49.25 | C145.1 v118,49.25 | C156.1 v150.75,66.75 | C157.1 v150.75,59.25 | C168.1 v171.75,49.25 | C167.1 v164.25,49.25 | C178.1 v171.75,33.25 | C179.1 v164.25,33.25 | C190.1 v171.75,17.25 | C189.1 163.75,17.25 | 163.75,17.25 v164.25,17.25 | v163.5,15.25 163.5,17 163.75,17.25 | v45.75,41.75 45.75,40.85 C199.1 45.65,40.55 IC20.6 | IC22.6 134.3,61.6 C201.1 134.9,61 v135.75,61 | IC21.6 125.4,56.55 C200.1
  Top 0.9: L7.1 85.1,68.6 v85.5,69 | 85,68 85,69.25
  Top 1: C200.1 125.6,58.4 125.5,58.5
  Route15 0.5: v42.75,12.75 43.5,13.5 46.5,13.5 49.75,16.75 49.75,19.75 52,22 52,23.25 52.5,23.75 v53.25,23.75 | 47.25,44 51,44 v51.25,44.25 57.75,44.25 59.5,42.5 v66.5,42.5 | 47.25,44 45.75,45.5 45.75,49.25 42.75,52.25 42.75,54.5 42,55.25 36.25,55.25 v36,55 35.75,54.75 28.75,54.75 28.25,55.25 21.25,55.25 v21,55 20.75,54.75 13.25,54.75 12.75,55.25 v6.25,55.25 5.75,55.75 v5.75,62.5 | v67.5,48 64.25,51.25 61,51.25 60.5,51.75 v51.25,51.75 51,52 51,56.25 44.75,62.5 43,62.5 42.5,63 36.25,63 v35.75,62.5 34.75,63.5 34.75,64.25 33.25,65.75 29.5,65.75 26.25,62.5 v20.75,62.5 20,62.5 17,65.5 16,65.5 13,62.5 v5.75,62.5 | v5.75,62.5 2.5,65.75 2.5,71.75 | v77,29 77,34.25 76,35.25 76,36.25 77,37.5 77,38.5 77.5,39 77.5,46 v77.25,46.25 77,46.5 77,47.5 82.5,53 83.5,53 85.75,55.25 85.75,56 86.75,57 95.5,57 v96,56.5 96,55 96.75,54.25 97.25,54.25 98.25,55.25 | v82.75,31 82.75,33.75 83.75,34.75 83.75,38 85,39.25 85,45.5 v84.75,45.75 85.5,45.75 89.25,49.5 95.75,49.5 v96,49.25 97.75,49.25 99,50.5 99,55.25 | 98.25,55.25 98.25,58.25 | 99,55.25 99,57.5 | 99,57.5 102,60.5 106.5,60.5 v106.75,60.25 110.25,56.75 110.25,50 110.5,49.75 | 98.25,55.25 98.5,55.25 | 98.5,55.25 98.75,55.25 | 98.75,55.25 99,55.25 | 99,57.5 98.75,57.75 | 98.75,57.75 98.25,58.25 | 98.5,57.75 98.5,55.25 | 98.75,55.25 98.75,57.75 | 98.25,58.25 94,62.5 94,64.5 94.75,65.25 98.25,65.25 99,66 99,66.75 99.75,67.5 106.5,67.5 v106.75,67.75 111,67.75 117.75,61 117.75,57.25 117.25,56.75 117.25,56.25 118,55.5 v118,49.25 118,46.75 118.25,46.5 v122.5,46.5 | 110.5,49.75 114.75,45.5 v122.5,45.5 | v110,49.25 110.5,49.75 | v127.5,64.5 141.5,64.5 141.75,64.25 142.25,64.25 143,65 143,65.5 144.25,66.75 v150.75,66.75 151,67 156.25,67 159.75,63.5 169.75,63.5 171.75,61.5 171.75,58.25 172,58 172,57.5 171.75,57.25 v171.75,49.25 175.75,45.25 175.75,42.75 171.75,38.75 v171.75,33.25 171.75,31.75 173,30.5 175.25,30.5 177.25,28.5 177.25,26.25 174.25,23.25 172.5,23.25 171.75,22.5 v171.75,17.25 184,17.25
  Route15 0.5: v127.5,63 134.5,63 | 134.5,63 139.5,63 141.5,61 143.25,61 144.25,60 150,60 v150.75,59.25 154.75,55.25 163,55.25 164.25,54 v164.25,49.25 165.5,48 165.5,40.25 164.25,39 v164.25,33.25 164.25,27.25 165.5,26 165.5,25 164.25,23.75 v164.25,17.25 | 185.25,23.25 185.25,22.75 | v163.5,15.25 166,12.75 184.75,12.75 | v45.75,41.75 45.75,42.5 47.25,44 | v135.75,61 135.25,61 134.5,61.75 134.5,63
  other vias: 41.75,12.75 40.75,12.75 39.75,12.75 70.75,27.25 70.75,26.25 85.5,69.75 123.5,72 124.25,72 125.75,72 125,72
  pour Top (isolate 0.3, no thermals): 40,20 40,18.5 40.75,17.5 40.75,13.75 41.25,13.25 41.75,13.25 43,13.25 43.5,13.75 45,13.75 45,12.75 43.75,12.75 43.25,12.25 39.5,12.25 36.75,15 36.75,19.25 37.5,20
  pour Route15 (isolate 0.3, no thermals): 39.75,13 39.5,12.75 39.5,10.5 40.5,9.5 51.5,9.5 52.25,8.75 87.75,8.75 87.75,15 51,15 48,12 44,12 43,13
  pour Route15 (isolate 0.3, no thermals): 67,14.5 68,15.5 70.25,15.5 70.75,15.5 73,17.75 73,32.75 72,33.75 72,35.25 72,49.75 70,49.75 69.75,49.75 69.75,24.5 69.75,18 66.75,18 65,16.25 65,14.5
  pour Top (isolate 0.3, no thermals): 69.25,27.5 70.5,28.75 71,28.75 71.25,28.5 71.25,26 71,25.75 70.5,25.75 69.25,27
  pour Route15 (isolate 0.3, no thermals): 6.25,71.75 1.75,71.75 arc-90 0.5,73 arc-90 1.75,74.25 185.25,74.25 arc-90 186.5,73 arc-90 185.25,71.75 181,71.75
  pour Route15 (isolate 0.3, no thermals): 72,49.25 72,54 85.75,67.75 85.75,72 81.25,72 81.25,66.5 78,63.25 74.5,63.25 69.75,58.5 69.75,49.25
  pour Top (isolate 0.3, no thermals): 84.25,69.5 84.75,70 85.75,70 86,69.75 86,69 85.75,68.75 85,68.75
  pour Route15 (isolate 0.3, no thermals): 186.5,73 186.5,13.5 arc-90 185.25,12.25 arc-90 184,13.5 184,73 arc-90 185.25,74.25 arc-90
  pour Top (isolate 0.3, no thermals): 122.25,47.5 122.25,45 122.5,44.75 123.5,44.75 123.75,45 123.75,48.5 124.5,49.25 127,49.25 130,52.25 130,59.75 127.75,62 127.75,66 126.5,67.25 126.5,72 126,72.5 123.25,72.5 122.75,72 122.75,63.75 123.25,63.25 123.25,59.5 124,58.75 124.5,58.75 125.25,58 126.75,58 127,58.25 127.5,58.25 127.75,58 128,57.75 128.25,57.5 128.5,57.25 128.5,52.75 126.75,51 126.5,50.75 125.25,50.75 125,50.5 123,50.5 122.25,49.75
12V  (via drill 0.3, 0.5)
  Top 0.2: IC16.2 47,24.59 47,23.5 48.4,22.1 C40.2 | T2.D1 108.3,25.2 109,24.5 109,23 109.5,23 C16.P$1 | C27.P$1 138.75,29 139.2,28.55 T3.D1
  Top 0.3: 98,19.5 98,18.25
  Top 0.5: C14.P$1 93.25,21.25 | IC2.5 92.75,29.91 92.65,30 C21.1 | IC1.5 13.72,20.5 v13,20.5 13,20.65 C8.1 | IC16.6 48.13,32 v48.25,32 | C40.2 v50,21.25
  Top 0.8: 93.25,21.25 v93.25,23.75 | v94,30.5 93.41,29.91 92.75,29.91
  Route15 0.5: v48.25,32 49.25,32 51,30.25 51,22.25 v50,21.25
  Route15 0.8: v93.25,23.75 93.5,24 93.5,30 v94,30.5 | v13,20.5 13.5,20 v21.25,20 | v143.75,44 v135,44
  pour Top (isolate 0.3): 29.25,4.25 29.25,7.75 39.75,7.75 39.75,4.25
  pour Top (isolate 0.3, no thermals): 29.5,7.5 29.5,9 arc90 26.5,12 24,12 arc-90 21,15 21,26 21.75,26.75 21.75,28.5 20.25,30 19,30 18.5,30.5 18.5,30.75 18.75,31 20.5,31 21.75,32.25 27,32.25 28.25,33.5 31,33.5 31,31.5 arc-90 27.75,28.25 arc90 25,25.5 25,24 25,15.5 arc90 26.25,14.25 33,14.25 arc-90 39.5,7.75 39.5,6.5 29.5,6.5
  pour Top (isolate 0.2, no thermals): 46.75,25 46.5,23.5 47.75,22 49,22 47.25,23.25
  pour Top (isolate 0.2, no thermals): 47.75,21.75 47.75,16.75 46,15 46,12.25 45.5,11.75 45.25,11.5 37.5,11.5 37.5,6.75 39.5,6.75 39.5,7.75 arc-90 41,9.25 46,9.25 arc90 49.25,12.5 49.25,16.5 49,16.75 49,21.75
  pour Top (isolate 0.2, no thermals): 94.25,23 94.25,21 94.75,20.5 101.25,20.5 101.75,21 103.25,21 103.75,20.5 104.25,20.5 106,22.25 106,23.25 106.25,23.5 106.25,23.75 106.5,23.75 106.5,23.5 107,23 107.5,23.5 107.5,23.75 107.75,23.75 107.75,23.5 108.25,23 108.75,23.5 108.75,23.75 109,23.75 109,23.5 112,23.5 112.5,23 112.5,19 112.25,18.75 94.5,18.75 94,19.25 94,19.75 93,20.75 93,23
  pour Top (isolate 0.2, no thermals): 101,26.5 101,25.5 100.75,25.25 100.75,23.75 101.75,22.75 101.75,20.75 103.25,20.75 103.25,23 103.5,23.25 103.5,25 103,25.5 103,26.5
  pour Top (isolate 0.2, no thermals): 101.5,26.75 103.75,25.75 106.5,25.5 106.5,25.25 103,24.75 101.5,26
  pour Top (isolate 0.3): 93,4 112.75,4 112.75,9.25 93,9.25
  pour Top (isolate 0.3): 93,8.75 93,9.25 arc-90 94.25,10.5 95,10.5 arc90 96.75,12.25 96.75,17.5 arc90 95.25,19 95.25,19.25 100.75,19.25 100.75,19 arc90 99.25,17.5 99.25,15.25 99.25,12 arc90 100.75,10.5 104.25,10.5 arc90 105.75,12 105.75,17.5 arc90 104.25,19 104.25,19.25 109.75,19.25 109.75,19 arc90 108.25,17.5 108.25,16 108.25,12 arc90 109.75,10.5 111.5,10.5 arc-90 112.75,9.25 112.75,8.25 93,8.25
  pour Top (isolate 0.2, no thermals): 17,29.5 17,29 17.5,28.5 18.5,28.5 21.25,25.75 22.5,24.5 24.5,24.5 24.5,28.5 22.25,28.5 21.25,29.5 20.5,28.75 20,28.75 19.75,29 19.75,29.5 19.5,29.5 19.5,29 19.25,28.75 18.75,28.75 18.5,29 18.5,29.5 18.25,29.5 18.25,29 18,28.75 17.5,28.75 17.25,29 17.25,29.5
  pour Top (isolate 0.2, no thermals): 94,30.75 93.5,31 arc-37 93.25,31.25 arc21 92.5,32.25 92.5,29.75 93.5,29.75 94.25,30.5
  pour Top (isolate 0.2, no thermals): 12,22 13.75,22 14.25,21.5 14.25,20.25 14,20 13,20 11.75,21.25 11.75,22
  pour Top (isolate 0.2, no thermals): 111.5,18.75 111.75,18.75 arc-90 113.5,17 113.5,13.5 arc90 115,12 125.5,12 arc90 127,13.5 arc15 126.25,19.25 arc-96 130,25 arc2 137.25,26.25 137.5,26.5 138,26.5 138,26.75 137.5,26.75 137.25,27 137.25,27.5 137.5,27.75 138,27.75 138,28 137.5,28 137.25,28.25 137.25,28.75 137.5,29 138,29 138,29.25 137.5,29.25 137.25,29.5 136.75,30 136.75,31.5 137.5,32.25 138.5,32.25 139,31.75 139,31.5 arc23 139.25,30.25 139.5,30.25 139.75,31.5 139.75,34.5 138.5,34.5 136.5,36.5 arc-46 135.5,39 135.5,47.75 131.5,47.75 131.5,29.75 arc-67 130,27.5 arc-17 129,27.25 126.75,27.25 arc90 123.25,23.75 123.25,21 arc-90 119,16.75 arc-77 115.25,19.75 arc56 112,23.5 111.25,23.5 111.25,18.75
  pour Top (isolate 0.2, no thermals): 142.75,42.75 142.75,43.75 143.25,44.25 143.5,44.5 144.5,44.5 145.25,43.75 145.25,43 144.75,42.5 143.5,42.5 143,42 142.75,42
  pour Top (isolate 0.3, no thermals): 49.25,12.25 arc-90 52,15 57.75,15 arc76 61.25,17.75 arc-79 62.25,18.5 64.5,18.5 arc-53 65,18.25 67,16.5 arc39 68.25,16 70.75,16 71,16 arc90 72.25,17.25 72.25,17.5 arc-90 73,18.25 95.75,18.25 arc-90 96.75,17.25 97.25,17.25 97.25,20.5 94,20.5 94,21 92.75,21 92.25,20.5 77.25,20.5 arc-50 74,22 arc50 68,24.75 arc65 60.25,19.75 arc-18 59.25,18.25 arc-47 57,17.25 51,17.25 arc-90 49,19.25 48.25,19.25 48.25,12.25
AGND
  Top 0.3: IC16.3 48.13,23.36 48.5,23 49.75,23 VIA1.P$1
  Top 0.5: C47.2 52.75,33.25 54.75,31.25 54.75,27.25 | 54.75,27.25 54.75,24 53.5,22.75 VIA1.P$1 | C48.2 R17.1 53.35,27.5 54,27.5 | 54,27.25 53.5,27.25 | 54,27.25 54.25,27.25 | 54.25,27.25 54.25,27.5 | 54.25,27.5 54,27.5 | 54,27.5 54,27.25 | 54.25,27.25 54.75,27.25 | 54.25,27.5 54.5,27.5
CLK1
  Top 0.152: IC4.9 59.25,49.25 arc62 60.5,50 arc-34 62,51.5 arc23 65,54 arc-9 R22.2
CLK2
  Top 0.152: R21.2 65.5,57 arc-17 50.75,59.25 arc19 IC5.9
CLK3
  Top 0.152: R20.2 arc32 40.5,67.25 arc12 35,67.25 arc81 30,62 30,61 arc-90 29.25,60.25 IC6.9
CLK4
  Top 0.152: R19.2 arc13 62.75,60.5 arc21 51.75,66.25 arc19 22.75,70 22.5,70 arc90 15,62.5 15,61 arc-90 14.25,60.25 IC7.9
CLK5
  Top 0.152: R23.2 74.25,51.75 arc49 72.25,47 72.25,35.75 arc90 77.25,30.75 79.5,30.75 arc90 82.25,33.5 IC8.9
CLK6
  Top 0.152: IC9.9 82,51.75 arc-37 80.5,52.25 arc-32 R24.2
CLK7
  Top 0.152: IC10.9 96.25,62.75 arc29 87.5,60.5 arc-30 78.5,58.25 R25.2
CLK8
  Top 0.152: IC11.9 112.75,66 arc90 106.5,72.25 96,72.25 arc86 88.75,65.5 arc-73 84.5,60.5 arc-10 R26.2
CLK9
  Top 0.152: IC12.9 139.5,61.75 arc-90 135.25,66 135.25,67.75 arc-90 139.75,72.25 155.75,72.25 arc-57 158.5,70.75 arc58 161.75,69 R28.2
CLK10
  Top 0.152: R29.2 163.5,63 arc62 165,61.5 arc-63 166.75,58.5 IC13.9
CLK11
  Top 0.152: R30.2 arc-14 177.25,63 arc-69 180,59 180,51 arc-90 174.5,45.5 168.5,45.5 arc90 166.75,43.75 IC14.9
CLK12
  Top 0.152: R31.2 175.5,65.75 arc5 179.75,62.5 arc-57 181.5,59.25 181.5,35.25 arc-90 175.75,29.5 168.5,29.5 arc90 166.75,27.75 IC15.9
CNF_NI_1  (via drill 0.3)
  Top 0.2: IC4.2 59.5,45.75 v59.75,45.5 | v59,14.25 58.95,14.2 IC23.4
  Route15 0.2: v59,14.25 59,16.75 62.25,20 62.25,21.5 68,27.25 68,43.25 67.5,43.75 60.5,43.75 59.75,44.5 v59.75,45.5
CNF_NI_2  (via drill 0.3)
  Top 0.2: IC8.2 v78.75,37 | IC27.4 80.95,14.2 v81,14.25
  Route15 0.2: v78.75,37 78.75,25.75 81,23.5 v81,14.25
CNF_NI_3  (via drill 0.3)
  Top 0.2: IC12.2 v142,65.25 | IC25.4 69.95,14.2 v70,14.25
  Route15 0.2: v70,14.25 70.75,14.25 74,17.5 74,34 73,35 73,48.5 95.75,71.25 110.75,71.25 117,65 125.75,65 126,65.25 v142,65.25
CNF_PI_1  (via drill 0.3)
  Top 0.2: IC4.1 58.7,44.55 v59.25,44 | v57,14.25 57.05,14.2 IC23.6
  Route15 0.2: v57,14.25 57,15.5 61.75,20.25 61.75,21.75 67.5,27.5 67.5,42.75 67,43.25 60,43.25 v59.25,44
CNF_PI_2  (via drill 0.3)
  Top 0.2: IC8.1 78.25,37.75 v78,37.25 | IC27.6 79.05,14.45 v79,14.25
  Route15 0.2: v78,37.25 78,25.5 79,24.5 v79,14.25
CNF_PI_3  (via drill 0.3)
  Top 0.2: IC12.1 142.75,65.75 v142.25,66 | IC25.6 68.05,14.2 v68,14.25
  Route15 0.2: v142.25,66 141.75,66 141.5,65.75 125.75,65.75 125.5,65.5 117.25,65.5 111,71.75 95.5,71.75 72.5,48.75 72.5,34.75 73.5,33.75 73.5,17.75 70.75,15 68.25,15 68,14.75 v68,14.25
DGND  (via drill 0.3)  (1 unrouted)
  Top 0.2: IC4.8 60.65,48.75 C61.2 | IC4.23 52.75,52.6 C62.2 | C63.2 52.75,43.65 IC4.38 | IC5.8 45.25,59.75 v45.5,59.5 | C76.2 37.75,54.15 IC5.38 | IC5.23 37.75,63.25 37.5,63.5 37.25,63.5 37,63.75 37,64.25 36,65 36.1,65 C77.2 36.35,64.75 | IC6.8 v30.25,59.75 30.9,59.75 C89.2 | IC6.38 22.75,54.15 C91.2 | IC6.23 22.75,63.25 22.5,63.5 22.25,63.5 22,63.75 22,64.25 21.75,64.5 C90.2 | IC7.23 7.75,63.25 7.5,63.5 7.25,63.5 v7,63.75 | IC7.38 7.75,54.15 C102.2 | IC7.8 v15.25,59.75 | IC8.8 81.75,36.75 v81.5,36.5 | C112.2 76.4,44.25 IC8.38 | IC8.23 85.5,44.25 86,44.75 86,45.15 C113.2 | IC9.8 86.75,52.25 v86.5,52.5 | IC9.23 94.25,48.5 94.5,48.25 C124.2 | IC9.38 94.25,57.5 v94.75,58 | IC10.8 97.75,63.25 v97.5,63.5 | IC10.38 105.25,68.5 v105.75,69 | IC10.23 105.25,59.5 106,58.75 106,58.5 C134.2 | IC11.8 113.25,58.25 v113.5,58.5 | IC11.23 109.5,50.75 108.75,50 108.5,50 107.75,49 108,49.35 C146.2 | IC11.38 118.75,50.75 v119.25,50.25 | IC12.8 141.75,62.25 v141.5,62.5 | IC12.38 149.25,67.5 149.75,68 v149.75,68.5 | IC12.23 149.25,58.5 149.5,58.25 149.75,58.25 150,58 150,57.25 150.25,57 150.65,57 C157.2 150.75,57 | IC13.8 167.25,58.25 v167.5,58.5 | IC13.38 173,50.75 v173.5,50.25 | IC13.23 163.5,50.75 163.25,50.5 163.25,50.25 163,50 162.25,50 162,49.75 162,49.35 C167.2 | IC14.8 167.25,42.25 v167.5,42.5 | IC14.38 172.5,34.75 173,34.25 v173.5,34.25 | IC14.23 163.5,34.75 162.75,34 162.25,34 162,33.75 162,33.35 C179.2 | IC15.8 167.25,26.5 v167.5,26.75 | IC15.38 172.5,18.75 173,18.25 v173.5,18.25 | IC15.23 163.5,18.75 162.75,18 162.25,18 162,17.75 162,17.35 C189.2
  Top 0.3: IC19.10 68.64,55.14 67.9,54.4 C49.2 | C52.2 v65.25,59 | C55.2 55.75,11.4 57.7,11.4 58,11.1 IC23.2 | C56.2 61.25,12.1 63.3,12.1 63.5,12.3 IC24.2 | C57.2 66.75,11.4 68.7,11.4 69,11.1 IC25.2 | C58.2 72.25,12.1 74.2,12.1 74.5,12.4 IC26.2 | C59.2 77.75,11.4 79.7,11.4 80,11.1 IC27.2 | C60.2 83.25,12.1 85.2,12.1 85.5,12.4 IC28.2 | IC19.13 73.59,56.41 v73.5,56.5 | C51.2 v78.75,57 | C50.2 74.1,63.1 v74,63 | 75,70 75,70.34 X1.2 | IC19.2 70.47,60.22 v70.5,60.25 | IC19.6 70.43,57.68 v70.5,57.75 | IC19.17 73.8,58.95 v73.5,59.25
  Top 0.4: 76.25,45 v76.75,45.5 | v105.75,69 105.75,69.25 106.54,70.18 106.65,70 C135.2
  Top 0.5: C61.2 62.35,49.6 v62.5,49.75 | IC23.2 v58,9.25 | v63.5,14.25 IC24.2 | v69,9.25 IC25.2 | v74.5,14.25 IC26.2 | v80,9.25 IC27.2 | v85.5,14.25 IC28.2 | 75,70 74.6,69.6 C53.2 v73.25,70.75 | C73.2 83.15,70.35 v83.25,70.5 | C62.2 52.1,54.15 v52,54.25 | v51.75,41.75 51.85,41.85 C63.2 | C49.2 67.9,53.1 v68,53 68.4,52.6 C72.2 | C75.2 46.1,59.5 v45.5,59.5 | C54.2 172.97,67.86 IC18.6 170.13,67.86 v170,68 | C74.1 170.85,71.9 v170.75,72 | C77.2 35.4,64.85 v35.25,65 | v37,52.5 37,53.4 C76.2 | C90.2 20.4,64.85 v20.25,65 | v22,52.5 22,53.4 C91.2 | C101.2 v7,63.75 | v7,52.5 7,53.5 C102.2 | v15.25,59.75 15.6,60.1 C100.2 | v81.5,36.5 81.5,35.65 C111.2 | C112.2 76.15,44.9 | 76.15,44.9 76.25,45 75.75,45 | 76.15,44.9 76,44.75 | v87.25,45.5 86.35,45.5 C113.2 | C122.2 86.35,52.65 v86.5,52.5 | v96,47.25 96,48.15 C124.2 | v94.75,58 94.75,58.25 95.25,58.75 95.75,58.75 C123.2 | C133.2 97.35,63.65 v97.5,63.5 | C134.2 106.85,58 v107.75,58 | C144.2 113.65,58.65 v113.5,58.5 | v107,49.25 C146.2 | C145.2 120,49.35 120,50 119.75,50.25 v119.25,50.25 | C155.2 140.6,62.75 141.25,62.75 v141.5,62.5 | C156.2 150.65,69 150.25,69 v149.75,68.5 | 150.75,57 v151.75,57 | v167.5,58.5 167.65,58.65 C166.2 | C168.2 174,49.35 174,49.75 v173.5,50.25 | v161,49.25 162,49.25 | C177.2 167.65,42.65 v167.5,42.5 | C178.2 174,33.25 174,33.75 v173.5,34.25 | v161,33.25 C179.2 | C188.2 167.9,27.15 v167.5,26.75 | C190.2 174,17.35 174,17.75 v173.5,18.25 | v161,17.25 C189.2
  Route2 0.2: VIA2.P$1 65,30.5 65.25,30.25
  Route2 1: 61,31.75 65.25,31.75 65.25,31 | 65.25,31 65.25,30.25 61.25,30.25 61.25,31 65.25,31 | VIA3.P$1 44,16.25 44.5,16.25 | 44.5,16.25 44.5,22 43.75,22 43.75,18.5 41.75,18.5 41.75,18 43.75,18 43.75,16.25 | 44.5,16.25 55.75,16.25 v55.75,9.25
  other vias: 60.25,9.25 61.25,9.25 87.75,9.25 83.25,9.25 82.25,9.25 77.75,9.25 76.75,9.25 72.25,9.25 71.25,9.25 65.75,9.25 66.75,9.25
  pour Route2 (isolate 0.3, no thermals): 0,75 0,12 187,12 187,75
  pour Route2 (isolate 0.3, no thermals): 39.25,12.7 87.7,12.7 87.7,8.7 39.25,8.7
  pour Top (isolate 0.3): 55.25,9.25 56.25,8.25 56.25,4 86.75,4 86.75,8 88,9.25
N$1  (via drill 0.3)
  Top 0.2: IC4.36 50.75,45.25 v50.25,45 | IC5.1 44.5,56.25 v44.75,56
  Route15 0.2: v44.75,56 44.75,51.75 46.75,49.75 46.75,45.75 47.5,45 v50.25,45
N$2  (via drill 0.3)
  Top 0.2: IC4.35 v50,45.75 | IC5.2 v45,56.75
  Route15 0.2: v50,45.75 48.25,45.75 47.5,46.5 47.5,50.25 46.75,51 46.75,55.5 45.5,56.75 v45,56.75
N$3  (via drill 0.3)
  Top 0.2: IC6.1 29.25,56.25 v29.75,56 | IC5.36 35.75,56.25 v35.25,56
  Route15 0.2: v29.75,56 30,56 30.5,56.25 34.5,56.25 34.75,56 v35.25,56
N$4  (via drill 0.3)
  Top 0.2: IC6.2 v30,56.75 | IC5.35 v35,56.75
  Route15 0.2: v30,56.75 v35,56.75
N$5  (via drill 0.3)
  Top 0.2: IC7.1 14.25,56.25 v14.75,56 | IC6.36 20.75,56.25 v20.25,56
  Route15 0.2: v14.75,56 15,56 15.5,56.25 19.25,56.25 19.5,56 v20.25,56
N$6  (via drill 0.3)
  Top 0.2: IC7.2 v15,56.75 | IC6.35 v20,56.75
  Route15 0.2: v15,56.75 v20,56.75
N$7
  Top 0.5: R4.1 C12.2
N$8
  Top 0.5: IC1.2 16.64,28.11 15.85,28.91 T1.1
N$9  (via drill 0.3)
  Top 0.5: T1.8 v14.75,35.5 | IC1.4 13.63,27.25 v13.25,27.25 12.15,27.25 R5.2
  Route15 0.5: v14.75,35.5 14.75,28.75 v13.25,27.25
N$10
  Top 0.5: C10.1 19.39,24.36 17.91,25.84 IC1.1
N$11
  Top 0.5: IC1.7 16.64,18.36 C13.2 18.85,18.33 R3.2
N$12
  Top 0.5: C11.1 18.85,16.33 R3.1
N$13  (via drill 0.3)
  Top 0.2: IC8.36 78.25,46.25 v78,46.75 | IC9.1 87.75,55.75 v87.25,56
  Route15 0.2: v78,46.75 78.5,46.25 79,46.25 79.5,46.75 79.5,48.25 83,51.75 84.25,51.75 87,54.5 87.25,54.5 87.75,55 87.75,55.5 v87.25,56
N$14  (via drill 0.3)
  Top 0.2: IC8.35 v78.75,47 | IC9.2 v87,55.25
  Route15 0.2: v78.75,47 78.75,48.25 82.75,52.25 84,52.25 v87,55.25
N$15
  Top 0.5: IC1.6 15.37,18.79 C13.1 | 14.9,18.33 C13.1 | C13.1 C11.2 15.15,14.63 C12.1 | R2.2 11.33,18.1 R1.1 14.67,18.1 C13.1
N$16  (via drill 0.3)
  Top 0.2: IC9.36 96.25,55.75 v96.75,56 | IC10.1 98.75,66.75 v98.25,67
  Route15 0.2: v96.75,56 96.75,58 92.75,62 92.75,65.25 94.5,67 v98.25,67
N$17  (via drill 0.3)
  Top 0.2: IC9.35 v97,55.25 | IC10.2 v98,66.25
  Route15 0.2: v97,55.25 97.5,55.75 97.5,58 93.25,62.25 93.25,65 94.5,66.25 v98,66.25
N$18  (via drill 0.3)
  Top 0.2: IC10.36 107.5,66.75 v107.75,67 | IC11.1 116.75,57.25 v117,57.75
  Route15 0.2: v107.75,67 110.75,67 117,60.75 v117,57.75
N$19  (via drill 0.3)
  Top 0.2: IC10.35 v108,66.25 | IC11.2 v116.25,58
  Route15 0.2: v108,66.25 110.75,66.25 116.25,60.75 v116.25,58
N$20  (via drill 0.3)
  Top 0.2: IC15.1 170.75,25.25 v171,25.75 | IC14.36 170.75,32.5 v171,32.25
  Route15 0.2: v171,32.25 v171,25.75
N$21  (via drill 0.3)
  Top 0.2: IC15.2 v170.25,26 | IC14.35 v170.25,32
  Route15 0.2: v170.25,32 v170.25,26
N$22  (via drill 0.3)
  Top 0.2: IC14.1 170.75,41.25 v171,41.75 | IC13.36 170.75,48.75 v171,48.25
  Route15 0.2: v171,48.25 v171,41.75
N$23  (via drill 0.3)
  Top 0.2: IC14.2 v170.25,42 | IC13.35 v170.25,48
  Route15 0.2: v170.25,48 v170.25,42
N$24  (via drill 0.3)
  Top 0.2: IC13.1 170.75,57.25 v171,57.75 | IC12.36 151.25,65.75 v151.75,66
  Route15 0.2: v151.75,66 156,66 159.25,62.75 169.5,62.75 171,61.25 v171,57.75
N$25  (via drill 0.3)
  Top 0.2: IC13.2 v170.25,58 | IC12.35 v152,65.25
  Route15 0.2: v152,65.25 155.75,65.25 158.75,62.25 169.25,62.25 170.25,61.25 v170.25,58
N$26  (via drill 0.3)
  Top 0.5: T1.S1_D2 17.82,33 v21,33 | IC1.8 17.91,21.25 v19.5,21.25 19.57,21.25 C10.2
  Route15 0.5: v21,33 19.5,31.5 v19.5,21.25
  pour Top (isolate 0.2, no thermals): 17.75,34.25 5.75,34.25 5.75,32 18.75,32 18.75,34.25
N$27  (via drill 0.3)
  Top 0.5: T3.1 137.25,31.16 v137.25,31.25 | IC3.2 140.5,36.91 v140.5,35.25